# EAGLE design BSAT - Transmission Shield (EAGLE 6.5.0)
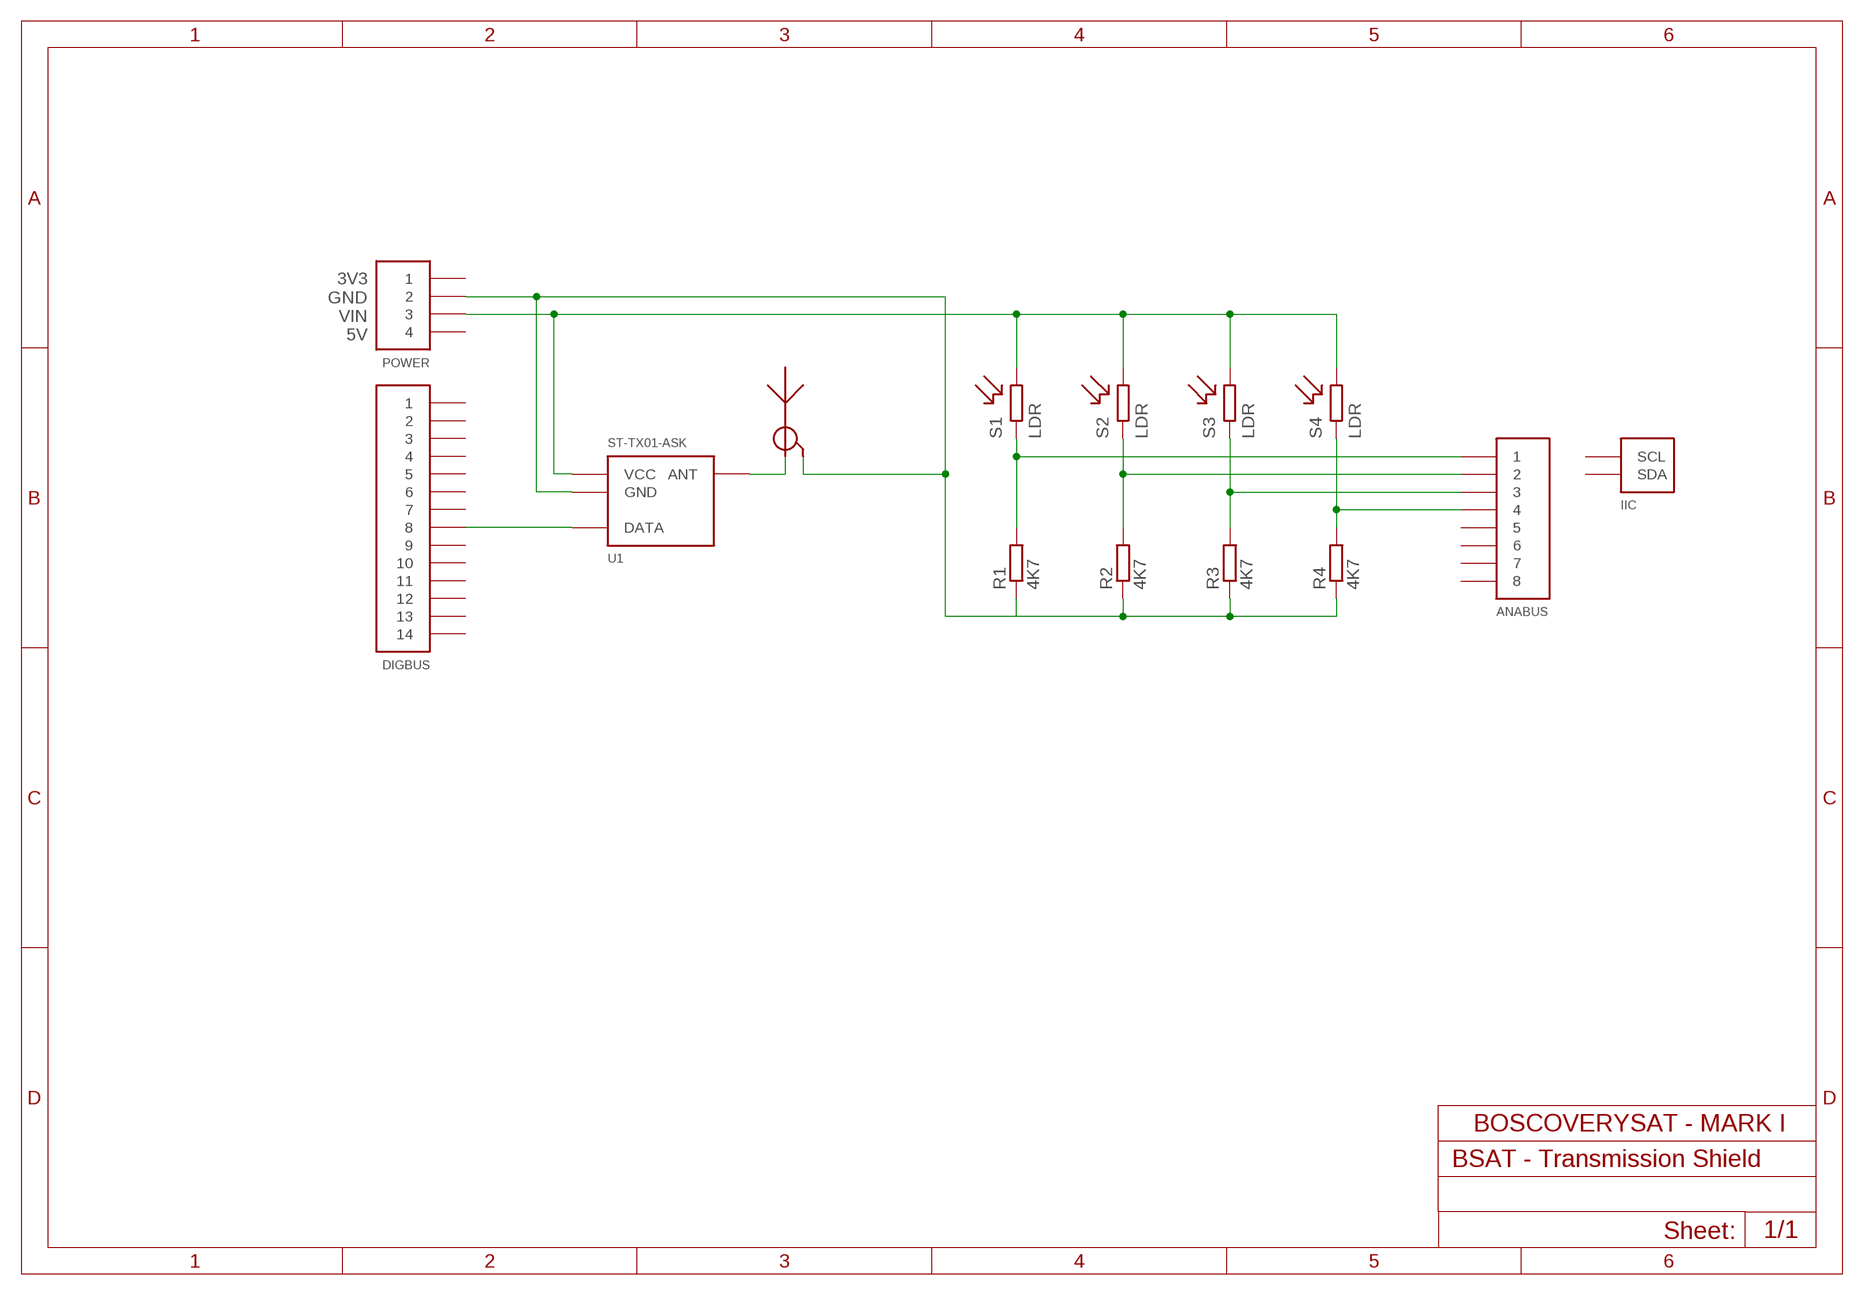
[diagram p0: schematic, sheet 1]

## Parts
ANABUS  8-PIN-DUAL-BUS  [8-PIN-DUAL-BUS]
DIGBUS  14-PIN-DUAL-BUS  [14-PIN-DUAL-BUS]
IIC  IIC-DUAL-BUS  [2-PIN-DUAL-BUS]
POWER  4-PIN-DUAL-BUS  [4-PIN-LINEAL-JUMPER]
R1  4K7  R-EU_0207/12  [0207/12]
R2  4K7  R-EU_0207/12  [0207/12]
R3  4K7  R-EU_0207/12  [0207/12]
R4  4K7  R-EU_0207/12  [0207/12]
S1  LDR  [2-PIN-JUMPER]
S2  LDR  [2-PIN-JUMPER]
S3  LDR  [2-PIN-JUMPER]
S4  LDR  [2-PIN-JUMPER]
U1  ST-TX01-ASK  [ST-TX01-ASK]
U$5  ANTENNA  [ANTENNA]

## Nets
N$1: ANABUS.1A ANABUS.1B R1.2 S1.P$2
N$2: ANABUS.2A ANABUS.2B R2.2 S2.P$2
N$3: ANABUS.3A ANABUS.3B R3.2 S3.P$2
N$4: ANABUS.4A ANABUS.4B R4.2 S4.P$2
N$5: POWER.3A POWER.3B S1.P$1 S2.P$1 S3.P$1 S4.P$1 U1.VCC
N$6: DIGBUS.8A DIGBUS.8B U1.DATA
N$7: POWER.2A POWER.2B R1.1 R2.1 R3.1 R4.1 U1.GND U$5.GANT
N$8: U1.ANT U$5.ANT
Unconnected: ANABUS.5A ANABUS.5B ANABUS.6A ANABUS.6B ANABUS.7A ANABUS.7B ANABUS.8A ANABUS.8B DIGBUS.1A DIGBUS.1B DIGBUS.2A DIGBUS.2B DIGBUS.3A DIGBUS.3B DIGBUS.4A DIGBUS.4B DIGBUS.5A DIGBUS.5B DIGBUS.6A DIGBUS.6B DIGBUS.7A DIGBUS.7B DIGBUS.9A DIGBUS.9B DIGBUS.10A DIGBUS.10B DIGBUS.11A DIGBUS.11B DIGBUS.12A DIGBUS.12B DIGBUS.13A DIGBUS.13B DIGBUS.14A DIGBUS.14B IIC.1A(SDA) IIC.1B(SDA) IIC.2A(SCL) IIC.2B(SCL) POWER.1A POWER.1B POWER.4A POWER.4B

## Notes on the sheet
- 3V3
  GND
  VIN
  5V

## Library data of the parts
ANABUS = boscoverysat:8-PIN-DUAL-BUS
DIGBUS = boscoverysat:14-PIN-DUAL-BUS
IIC = boscoverysat:IIC-DUAL-BUS
POWER = boscoverysat:4-PIN-DUAL-BUS
R1-R4 = resistor:R-EU_: RESISTOR, European symbol
S1-S4 = boscoverysat:LDR
U1 = boscoverysat:ST-TX01-ASK
U$5 = boscoverysat:ANTENNA

## Board
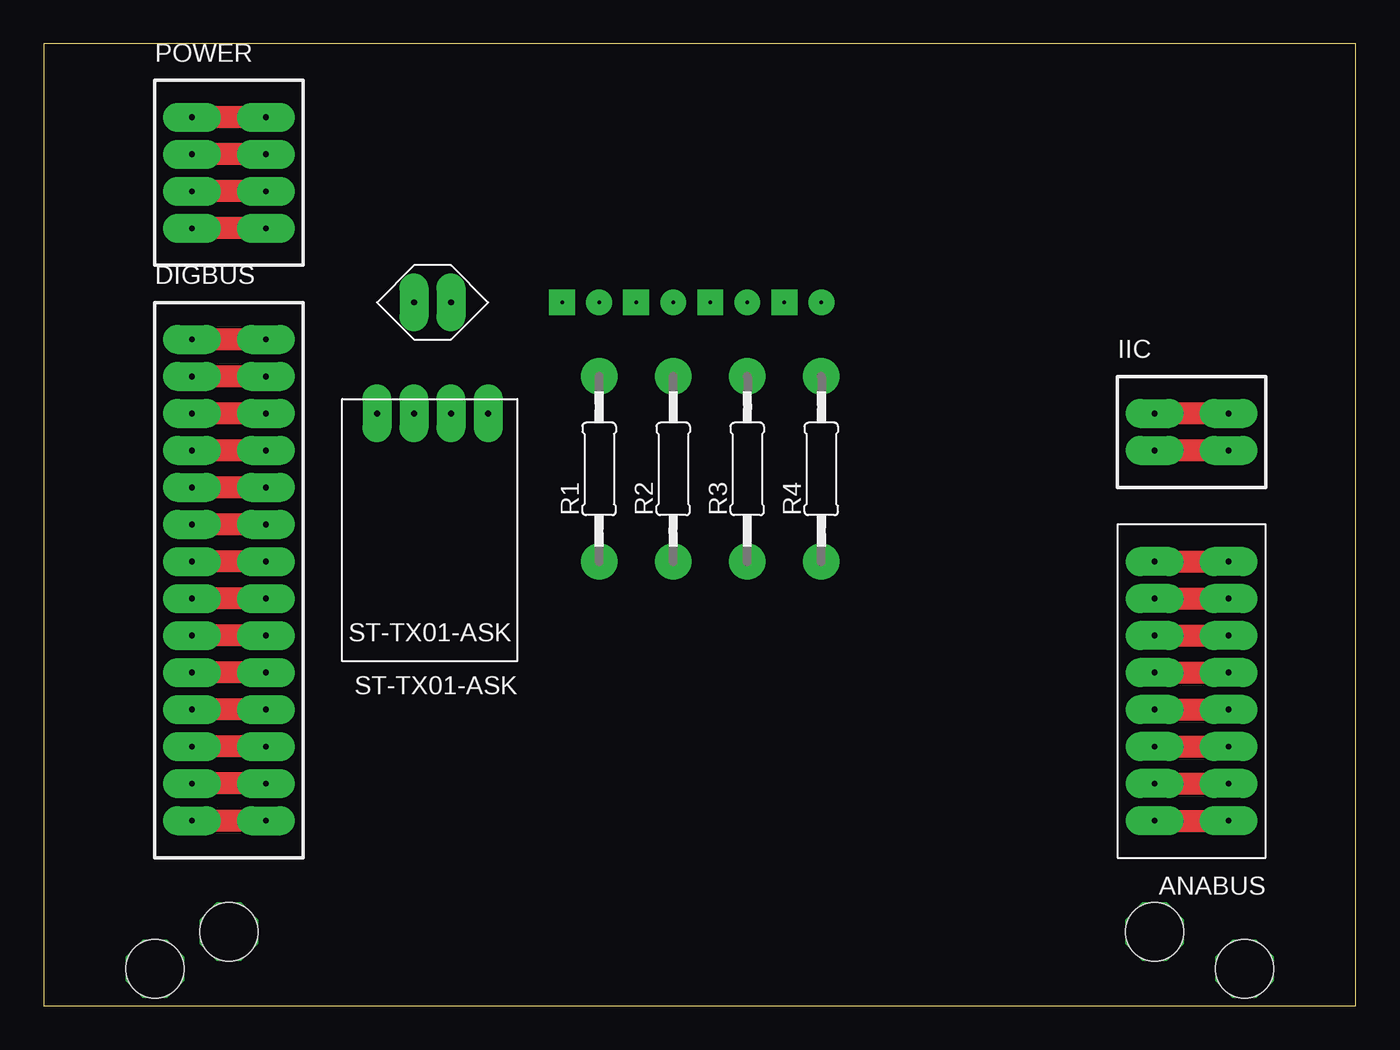
[diagram p1: board, top side]
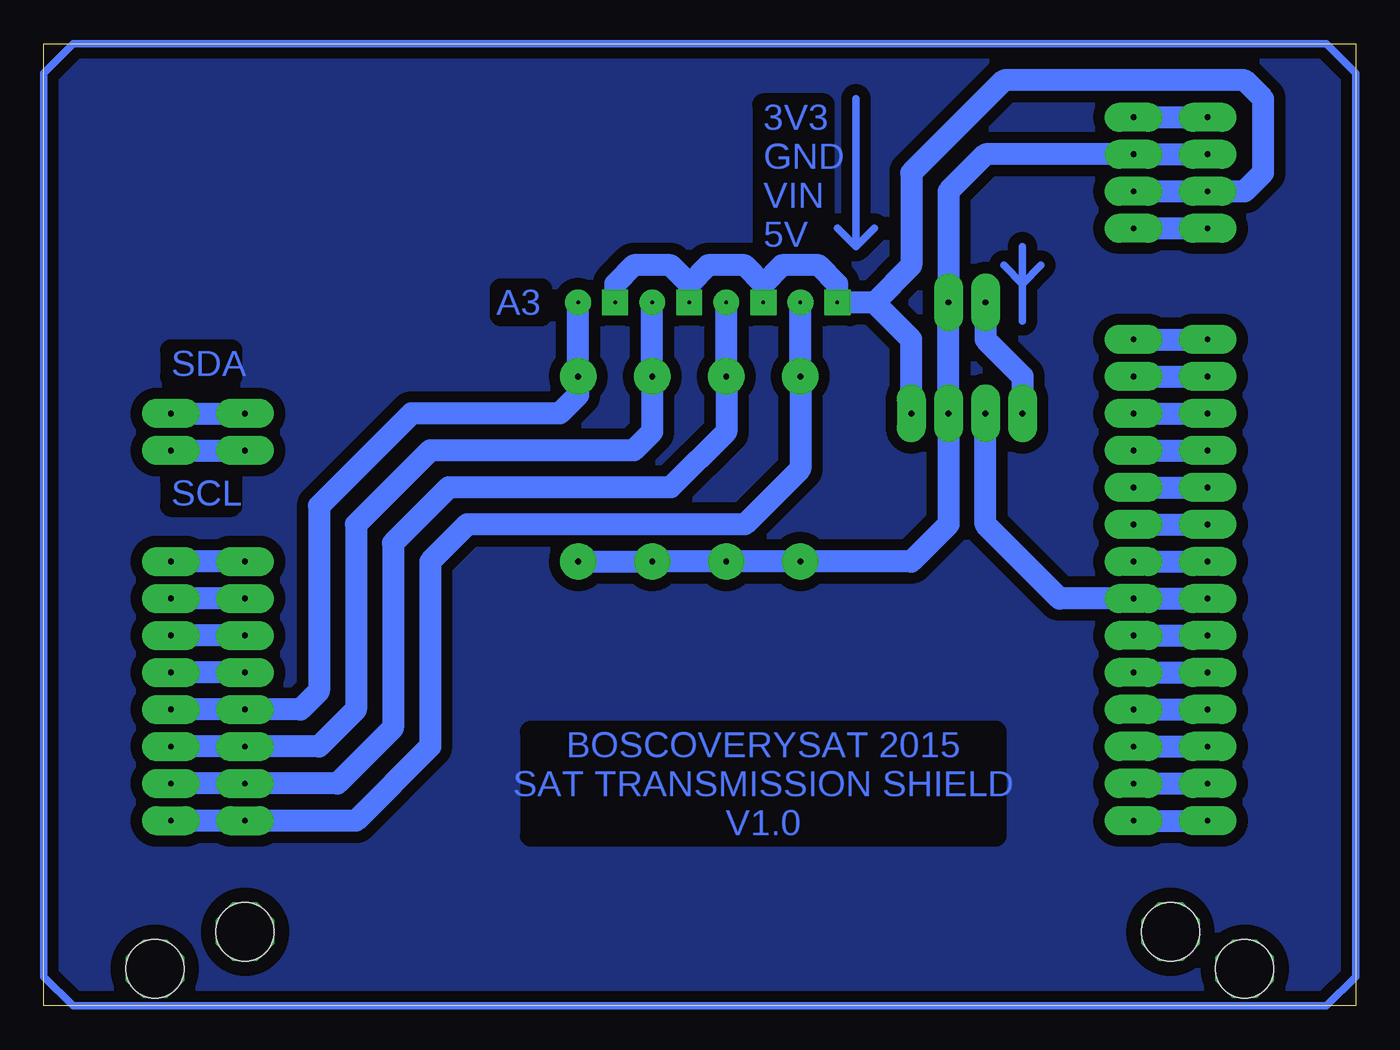
[diagram p2: board, bottom side, seen from below]

Size 90 x 66 mm. Coordinates in mm from the lower left corner, seen from the top.
Outline: 0,0 90,0 90,66 0,66 0,0
Copper layers (1*16): Top 0.035mm / dielectric 1.5mm / Bottom 0.035mm
Design rules "default *": minimum track width 10mil, minimum drill 24mil, track to track 30mil, track to pad 30mil, pad to pad 30mil, via to via 30mil, smd to smd 8mil, copper to edge 40mil, drill to drill 8mil, minimum pad ring 10mil, minimum via ring 8mil, stop-mask expansion 4mil, vias tented up to drill 0mil, thermal gap 10mil
Holes 4 mm at 7.62,2.54 12.7,5.08 76.2,5.08 82.38,2.54

### Footprints (pad centres in the part's own frame; a part is rotated, then mirrored left to right if it is on the bottom)
8-PIN-DUAL-BUS = drill 0.4 pad 2 long: 1A 0,17.78; 1B 5.08,17.78; 2A 0,15.24; 2B 5.08,15.24; 3A 0,12.7; 3B 5.08,12.7; 4A 0,10.16; 4B 5.08,10.16; 5A 0,7.62; 5B 5.08,7.62; 6A 0,5.08; 6B 5.08,5.08; 7A 0,2.54; 7B 5.08,2.54; 8A 0,0; 8B 5.08,0
14-PIN-DUAL-BUS = drill 0.4 pad 2 long: 1A 0,33.02; 1B 5.08,33.02; 2A 0,30.48; 2B 5.08,30.48; 3A 0,27.94; 3B 5.08,27.94; 4A 0,25.4; 4B 5.08,25.4; 5A 0,22.86; 5B 5.08,22.86; 6A 0,20.32; 6B 5.08,20.32; 7A 0,17.78; 7B 5.08,17.78; 8A 0,15.24; 8B 5.08,15.24; 9A 0,12.7; 9B 5.08,12.7; 10A 0,10.16; 10B 5.08,10.16; 11A 0,7.62; 11B 5.08,7.62; 12A 0,5.08; 12B 5.08,5.08; 13A 0,2.54; 13B 5.08,2.54; 14A 0,0; 14B 5.08,0
2-PIN-DUAL-BUS = drill 0.4 pad 2 long: 1A 2.54,5.08; 1B 7.62,5.08; 2A 2.54,2.54; 2B 7.62,2.54
4-PIN-LINEAL-JUMPER = drill 0.4 pad 2 long: 1A 0,7.62; 1B 5.08,7.62; 2A 0,5.08; 2B 5.08,5.08; 3A 0,2.54; 3B 5.08,2.54; 4A 0,0; 4B 5.08,0
0207/12 = drill 0.4 pad 2.5: 1 -6.35,0; 2 6.35,0
2-PIN-JUMPER = drill 0.254 pad 1.778 square: P$1 0,0 | drill 0.254 pad 1.778: P$2 2.54,0
ST-TX01-ASK = drill 0.4 pad 2 long: ANT 7.62,0; DATA 5.08,0; GND 2.54,0; VCC 0,0
ANTENNA = drill 0.4 pad 2 long: ANT 5.08,2.54; GANT 2.54,2.54

### Placement (x,y rotation side)
ANABUS  81.28,30.48 180 top
DIGBUS  10.16,12.7 0 top
IIC  73.66,35.56 0 top
POWER  10.16,53.34 0 top
R1  38.1,36.83 90 top
R2  43.18,36.83 90 top
R3  48.26,36.83 90 top
R4  53.34,36.83 90 top
S1  35.56,48.26 0 top
S2  40.64,48.26 0 top
S3  45.72,48.26 0 top
S4  50.8,48.26 0 top
U1  30.48,40.64 180 top
U$5  30.48,50.8 180 top

### Tracks (layer width: path | path; a pad name or v marks a point on that pad's centre or on a via)
N$1
  Bottom 1.524: S1.P$2 R1.2 38.1,36.83 41.91,33.02 60.96,33.02 63.5,30.48 63.5,17.78 68.58,12.7 ANABUS.1B
N$2
  Bottom 1.524: S2.P$2 R2.2 43.18,39.37 46.99,35.56 62.23,35.56 66.04,31.75 66.04,19.05 69.85,15.24 ANABUS.2B
N$3
  Bottom 1.524: S3.P$2 R3.2 48.26,39.37 49.53,38.1 63.5,38.1 68.58,33.02 68.58,20.32 71.12,17.78 ANABUS.3B
N$4
  Bottom 1.524: S4.P$2 R4.2 53.34,41.91 54.61,40.64 64.77,40.64 71.12,34.29 71.12,21.59 72.39,20.32 ANABUS.4B
N$5
  Bottom 1.524: U1.VCC 30.48,45.72 33.02,48.26 | 33.02,48.26 S1.P$1 35.56,49.53 36.83,50.8 39.37,50.8 40.64,49.53 | S2.P$1 40.64,49.53 | 40.64,49.53 41.91,50.8 44.45,50.8 45.72,49.53 | S3.P$1 45.72,49.53 | 45.72,49.53 46.99,50.8 49.53,50.8 50.8,49.53 S4.P$1 | 33.02,48.26 30.48,50.8 30.48,57.15 24.13,63.5 7.62,63.5 6.35,62.23 6.35,57.15 7.62,55.88 POWER.3A
N$6
  Bottom 1.524: DIGBUS.8B 20.32,27.94 25.4,33.02 U1.DATA
N$7
  Bottom 1.524: R4.1 R3.1 R2.1 R1.1 30.48,30.48 27.94,33.02 U1.GND U$5.GANT 27.94,55.88 25.4,58.42 POWER.2B
N$8
  Bottom 1.524: U$5.ANT 25.4,45.72 22.86,43.18 U1.ANT
N$9
  Bottom 0.508: 0,2 2,0 88,0 90,2 90,64 88,66 2,66 0,64 0,2
N$10
  Bottom 0.508: 34.29,62.23 34.29,52.07 | 34.29,52.07 35.56,53.34 | 33.02,53.34 34.29,52.07
N$11
  Bottom 0.508: 22.86,46.99 22.86,49.53 | 22.86,49.53 22.86,52.07 | 22.86,49.53 24.13,50.8 | 22.86,49.53 21.59,50.8
N$12  (via drill 0.4 pad 4)
  other vias: 7.62,2.54
N$13  (via drill 0.4 pad 4)
  other vias: 12.7,5.08
N$14  (via drill 0.4 pad 4)
  other vias: 76.2,5.08
N$15  (via drill 0.4 pad 4)
  other vias: 82.37,2.54
N$16
  pour Bottom: 2,66 0,64 0,2 2,0 88,0 90,2 90,64 88,66

### Text on the board
Bottom: 3V3 / GND / VIN / 5V | A3 | SDA | SCL | BOSCOVERYSAT 2015 / SAT TRANSMISSION SHIELD / V1.0